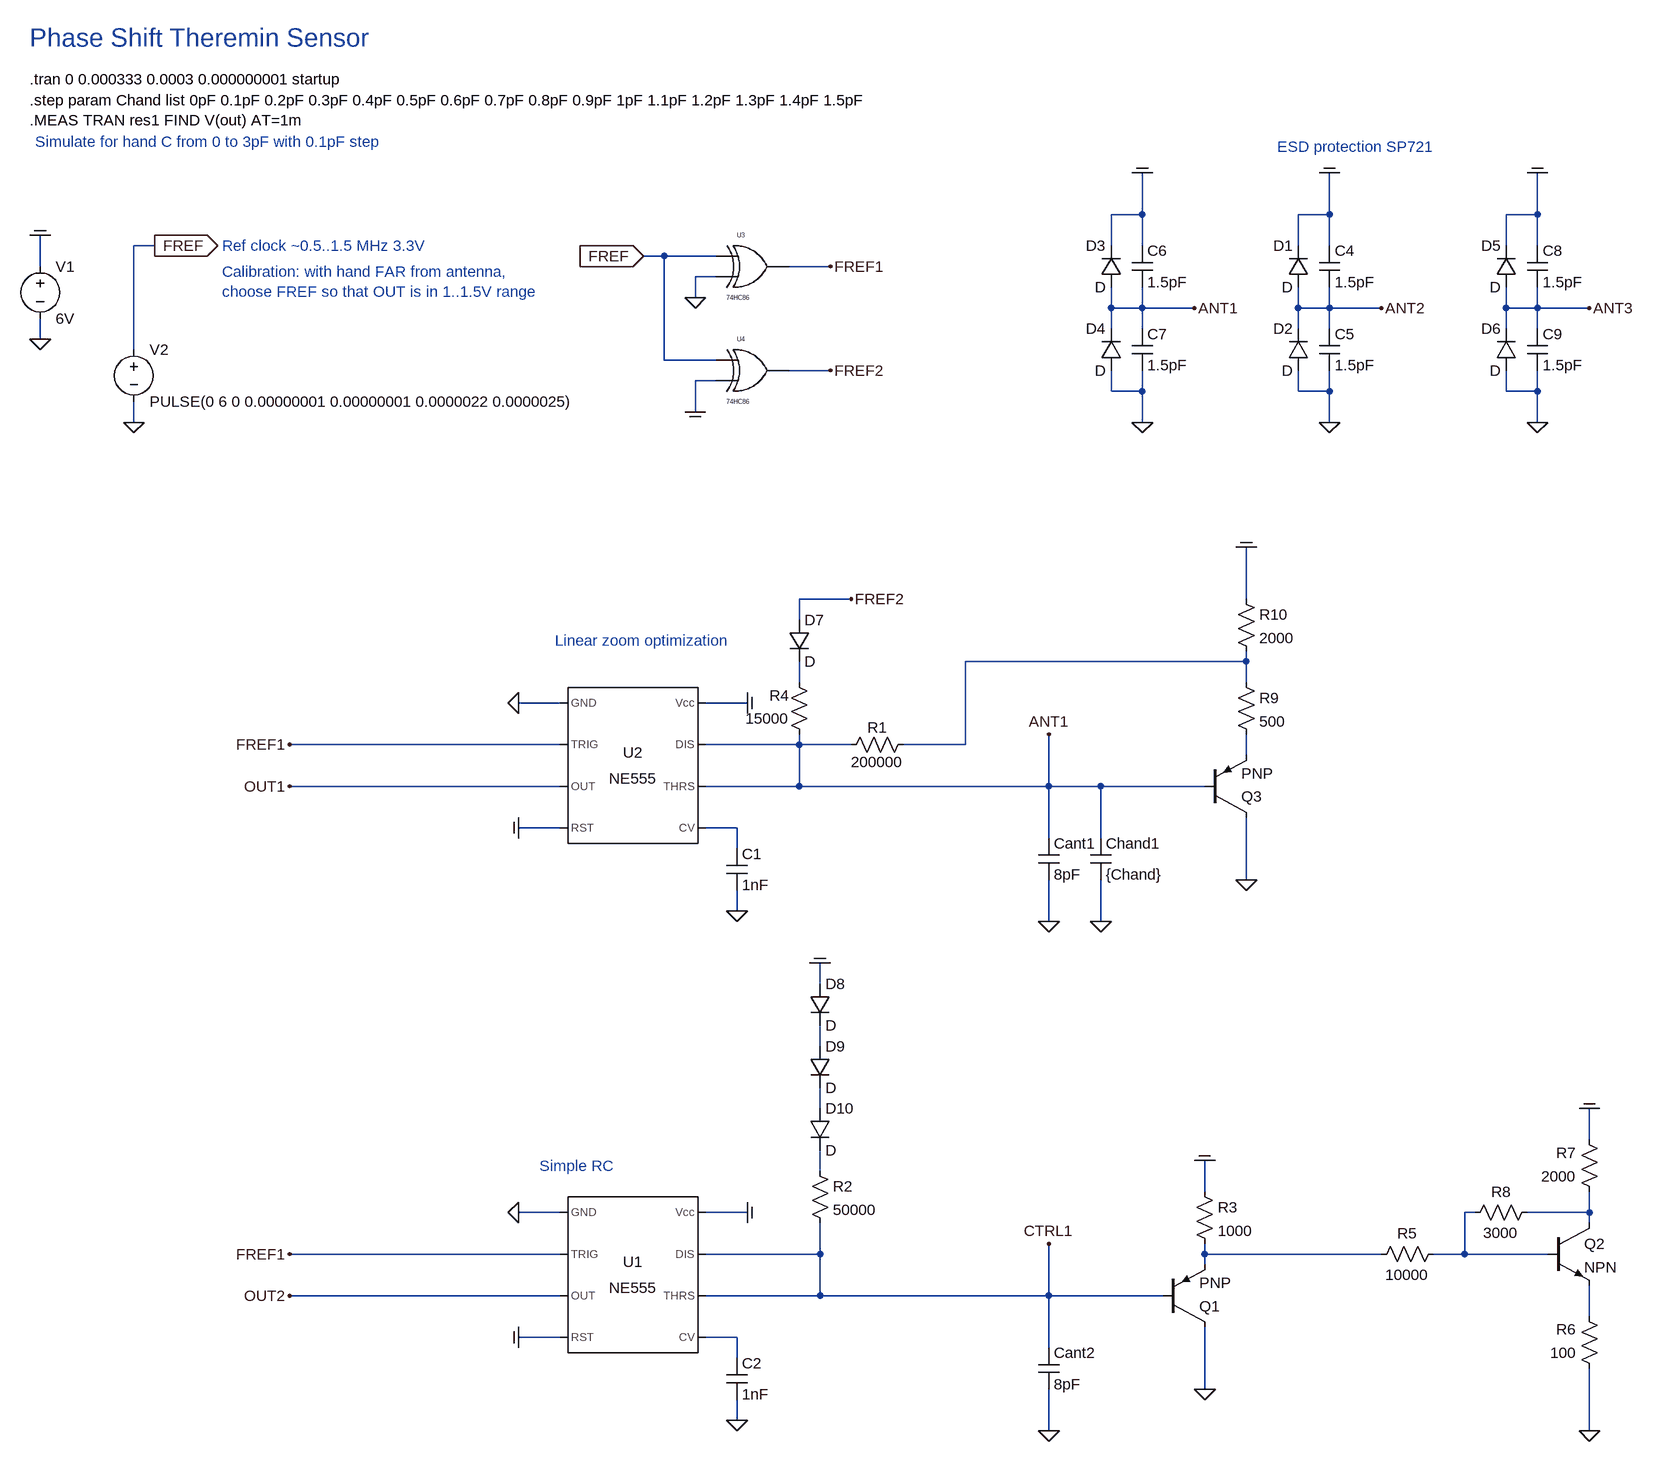
[diagram p0: schematic rc_sensor_v8_fast_linear_logscale.asc]
rc_sensor_v8_fast_linear_logscale.asc, the LTspice schematic file:
Version 4
SHEET 1 3724 2692
WIRE 1744 -96 1744 -160
WIRE 1744 -96 1696 -96
WIRE 2032 -96 2032 -160
WIRE 2032 -96 1984 -96
WIRE 2352 -96 2352 -160
WIRE 2352 -96 2304 -96
WIRE 224 -48 192 -48
WIRE 1696 -48 1696 -96
WIRE 1744 -48 1744 -96
WIRE 1984 -48 1984 -96
WIRE 2032 -48 2032 -96
WIRE 2304 -48 2304 -96
WIRE 2352 -48 2352 -96
WIRE 1008 -32 976 -32
WIRE 1088 -32 1008 -32
WIRE 48 -16 48 -64
WIRE 1264 -16 1200 -16
WIRE 1088 0 1056 0
WIRE 1056 32 1056 0
WIRE 1696 48 1696 16
WIRE 1744 48 1744 16
WIRE 1744 48 1696 48
WIRE 1824 48 1744 48
WIRE 1984 48 1984 16
WIRE 2032 48 2032 16
WIRE 2032 48 1984 48
WIRE 2112 48 2032 48
WIRE 2304 48 2304 16
WIRE 2352 48 2352 16
WIRE 2352 48 2304 48
WIRE 2432 48 2352 48
WIRE 1696 80 1696 48
WIRE 1744 80 1744 48
WIRE 1984 80 1984 48
WIRE 2032 80 2032 48
WIRE 2304 80 2304 48
WIRE 2352 80 2352 48
WIRE 48 96 48 64
WIRE 192 112 192 -48
WIRE 1008 128 1008 -32
WIRE 1088 128 1008 128
WIRE 1264 144 1200 144
WIRE 1088 160 1056 160
WIRE 1696 176 1696 144
WIRE 1744 176 1744 144
WIRE 1744 176 1696 176
WIRE 1984 176 1984 144
WIRE 2032 176 2032 144
WIRE 2032 176 1984 176
WIRE 2304 176 2304 144
WIRE 2352 176 2352 144
WIRE 2352 176 2304 176
WIRE 1056 208 1056 160
WIRE 192 224 192 192
WIRE 1744 224 1744 176
WIRE 2032 224 2032 176
WIRE 2352 224 2352 176
WIRE 1296 496 1216 496
WIRE 1904 496 1904 416
WIRE 1216 528 1216 496
WIRE 1904 592 1904 576
WIRE 1904 592 1472 592
WIRE 1216 624 1216 592
WIRE 1904 624 1904 592
WIRE 848 656 784 656
WIRE 1136 656 1072 656
WIRE 848 720 432 720
WIRE 1216 720 1216 704
WIRE 1216 720 1072 720
WIRE 1296 720 1216 720
WIRE 1472 720 1472 592
WIRE 1472 720 1376 720
WIRE 1904 736 1904 704
WIRE 848 784 432 784
WIRE 1216 784 1216 720
WIRE 1216 784 1072 784
WIRE 1600 784 1600 704
WIRE 1600 784 1216 784
WIRE 1680 784 1600 784
WIRE 1840 784 1680 784
WIRE 848 848 784 848
WIRE 1120 848 1072 848
WIRE 1600 864 1600 784
WIRE 1680 864 1680 784
WIRE 1120 880 1120 848
WIRE 1904 928 1904 832
WIRE 1120 976 1120 944
WIRE 1600 992 1600 928
WIRE 1680 992 1680 928
WIRE 1248 1088 1248 1056
WIRE 1248 1184 1248 1152
WIRE 1248 1280 1248 1248
WIRE 2432 1328 2432 1280
WIRE 1248 1376 1248 1344
WIRE 1840 1408 1840 1360
WIRE 848 1440 784 1440
WIRE 1136 1440 1072 1440
WIRE 2256 1440 2240 1440
WIRE 2432 1440 2432 1408
WIRE 2432 1440 2336 1440
WIRE 2432 1456 2432 1440
WIRE 848 1504 432 1504
WIRE 1248 1504 1248 1456
WIRE 1248 1504 1072 1504
WIRE 1840 1504 1840 1488
WIRE 2112 1504 1840 1504
WIRE 2240 1504 2240 1440
WIRE 2240 1504 2192 1504
WIRE 2368 1504 2240 1504
WIRE 1840 1520 1840 1504
WIRE 848 1568 432 1568
WIRE 1248 1568 1248 1504
WIRE 1248 1568 1072 1568
WIRE 1600 1568 1600 1488
WIRE 1600 1568 1248 1568
WIRE 1776 1568 1600 1568
WIRE 2432 1600 2432 1552
WIRE 848 1632 784 1632
WIRE 1120 1632 1072 1632
WIRE 1600 1648 1600 1568
WIRE 1120 1664 1120 1632
WIRE 1840 1712 1840 1616
WIRE 1120 1760 1120 1728
WIRE 1600 1776 1600 1712
WIRE 2432 1776 2432 1680
FLAG 48 96 0
FLAG 224 -48 FREF
IOPIN 224 -48 Out
FLAG 192 224 0
FLAG 1600 704 ANT1
FLAG 1600 992 0
FLAG 1680 992 0
FLAG 48 -64 COM
FLAG 1744 224 0
FLAG 1744 -160 COM
FLAG 1824 48 ANT1
FLAG 1136 656 COM
FLAG 784 656 0
FLAG 784 848 COM
FLAG 1120 976 0
FLAG 432 784 OUT1
FLAG 1056 32 0
FLAG 1056 208 COM
FLAG 976 -32 FREF
IOPIN 976 -32 In
FLAG 1264 -16 FREF1
FLAG 1264 144 FREF2
FLAG 432 720 FREF1
FLAG 1600 1776 0
FLAG 1136 1440 COM
FLAG 784 1440 0
FLAG 784 1632 COM
FLAG 1120 1760 0
FLAG 1248 1056 COM
FLAG 432 1568 OUT2
FLAG 432 1504 FREF1
FLAG 2032 224 0
FLAG 2032 -160 COM
FLAG 2112 48 ANT2
FLAG 2352 224 0
FLAG 2352 -160 COM
FLAG 2432 48 ANT3
FLAG 1296 496 FREF2
FLAG 1600 1488 CTRL1
FLAG 1840 1712 0
FLAG 1840 1360 COM
FLAG 2432 1280 COM
FLAG 2432 1776 0
FLAG 1904 928 0
FLAG 1904 416 COM
SYMBOL voltage 48 -32 R0
WINDOW 123 0 0 Left 2
WINDOW 39 0 0 Left 2
SYMATTR InstName V1
SYMATTR Value 6V
SYMBOL voltage 192 96 R0
WINDOW 123 0 0 Left 2
WINDOW 39 0 0 Left 2
SYMATTR InstName V2
SYMATTR Value PULSE(0 6 0 0.00000001 0.00000001 0.0000022 0.0000025)
SYMBOL cap 1584 864 R0
SYMATTR InstName Cant1
SYMATTR Value 8pF
SYMBOL cap 1664 864 R0
SYMATTR InstName Chand1
SYMATTR Value {Chand}
SYMBOL res 1392 704 R90
WINDOW 0 5 56 VBottom 2
WINDOW 3 27 56 VTop 2
SYMATTR InstName R1
SYMATTR Value 200000
SYMBOL diode 1712 16 R180
WINDOW 0 24 64 Left 2
WINDOW 3 24 0 Left 2
SYMATTR InstName D3
SYMBOL diode 1712 144 R180
WINDOW 0 24 64 Left 2
WINDOW 3 24 0 Left 2
SYMATTR InstName D4
SYMBOL cap 1728 -48 R0
SYMATTR InstName C6
SYMATTR Value 1.5pF
SYMBOL cap 1728 80 R0
SYMATTR InstName C7
SYMATTR Value 1.5pF
SYMBOL NE555 960 752 R0
SYMATTR InstName U2
SYMBOL cap 1104 880 R0
SYMATTR InstName C1
SYMATTR Value 1nF
SYMBOL cap 1584 1648 R0
SYMATTR InstName Cant2
SYMATTR Value 8pF
SYMBOL res 1232 1360 R0
SYMATTR InstName R2
SYMATTR Value 50000
SYMBOL cap 1104 1664 R0
SYMATTR InstName C2
SYMATTR Value 1nF
SYMBOL diode 2000 16 R180
WINDOW 0 24 64 Left 2
WINDOW 3 24 0 Left 2
SYMATTR InstName D1
SYMBOL diode 2000 144 R180
WINDOW 0 24 64 Left 2
WINDOW 3 24 0 Left 2
SYMATTR InstName D2
SYMBOL cap 2016 -48 R0
SYMATTR InstName C4
SYMATTR Value 1.5pF
SYMBOL cap 2016 80 R0
SYMATTR InstName C5
SYMATTR Value 1.5pF
SYMBOL diode 2320 16 R180
WINDOW 0 24 64 Left 2
WINDOW 3 24 0 Left 2
SYMATTR InstName D5
SYMBOL diode 2320 144 R180
WINDOW 0 24 64 Left 2
WINDOW 3 24 0 Left 2
SYMATTR InstName D6
SYMBOL cap 2336 -48 R0
SYMATTR InstName C8
SYMATTR Value 1.5pF
SYMBOL cap 2336 80 R0
SYMATTR InstName C9
SYMATTR Value 1.5pF
SYMBOL diode 1200 528 R0
SYMATTR InstName D7
SYMBOL res 1232 720 R180
WINDOW 0 31 76 Left 2
WINDOW 3 31 40 Left 2
SYMATTR InstName R4
SYMATTR Value 15000
SYMBOL 74hc86 1136 -80 R0
SYMATTR InstName U3
SYMATTR SpiceLine VCC=6  SPEED=1.0  TRIPDT=1e-9
SYMBOL 74hc86 1136 80 R0
SYMATTR InstName U4
SYMATTR SpiceLine VCC=6  SPEED=1.0  TRIPDT=1e-9
SYMBOL NE555 960 1536 R0
SYMATTR InstName U1
SYMBOL diode 1232 1088 R0
SYMATTR InstName D8
SYMBOL diode 1232 1184 R0
SYMATTR InstName D9
SYMBOL diode 1232 1280 R0
SYMATTR InstName D10
SYMBOL pnp 1776 1616 M180
SYMATTR InstName Q1
SYMBOL res 1824 1392 R0
SYMATTR InstName R3
SYMATTR Value 1000
SYMBOL npn 2368 1456 R0
SYMATTR InstName Q2
SYMBOL res 2208 1488 R90
WINDOW 0 0 56 VBottom 2
WINDOW 3 32 56 VTop 2
SYMATTR InstName R5
SYMATTR Value 10000
SYMBOL res 2448 1696 R180
WINDOW 0 36 76 Left 2
WINDOW 3 36 40 Left 2
SYMATTR InstName R6
SYMATTR Value 100
SYMBOL res 2448 1424 R180
WINDOW 0 36 76 Left 2
WINDOW 3 36 40 Left 2
SYMATTR InstName R7
SYMATTR Value 2000
SYMBOL res 2352 1424 R90
WINDOW 0 0 56 VBottom 2
WINDOW 3 32 56 VTop 2
SYMATTR InstName R8
SYMATTR Value 3000
SYMBOL pnp 1840 832 M180
SYMATTR InstName Q3
SYMBOL res 1888 608 R0
SYMATTR InstName R9
SYMATTR Value 500
SYMBOL res 1888 480 R0
SYMATTR InstName R10
SYMATTR Value 2000
TEXT 32 -304 Left 2 !.tran 0 0.000333 0.0003 0.000000001 startup
TEXT 32 -272 Left 2 !.step param Chand list 0pF 0.1pF 0.2pF 0.3pF 0.4pF 0.5pF 0.6pF 0.7pF 0.8pF 0.9pF 1pF 1.1pF 1.2pF 1.3pF 1.4pF 1.5pF\n.MEAS TRAN res1 FIND V(out) AT=1m
TEXT 328 -48 Left 2 ;Ref clock ~0.5..1.5 MHz 3.3V
TEXT 32 -368 Left 4 ;Phase Shift Theremin Sensor
TEXT 1952 -200 Left 2 ;ESD protection SP721
TEXT 328 -8 Left 2 ;Calibration: with hand FAR from antenna,\nchoose FREF so that OUT is in 1..1.5V range
TEXT 40 -208 Left 2 ;Simulate for hand C from 0 to 3pF with 0.1pF step
TEXT 840 560 Left 2 ;Linear zoom optimization
TEXT 816 1368 Left 2 ;Simple RC

The netlist it stands for:
* rc_sensor_v8_fast_linear_logscale.asc
V1 COM 0 6V
V2 FREF 0 PULSE(0 6 0 0.00000001 0.00000001 0.0000022 0.0000025)
Cant1 ANT1 0 8pF
Chand1 ANT1 0 {Chand}
R1 N001 ANT1 200000
D3 ANT1 COM D
D4 0 ANT1 D
C6 COM ANT1 1.5pF
C7 ANT1 0 1.5pF
XU2 0 FREF1 OUT1 COM N004 ANT1 ANT1 COM NE555  ; pins GND TRIG OUT RST CV THRS DIS Vcc
C1 N004 0 1nF
Cant2 CTRL1 0 8pF
R2 N007 CTRL1 50000
C2 N012 0 1nF
D1 ANT2 COM D
D2 0 ANT2 D
C4 COM ANT2 1.5pF
C5 ANT2 0 1.5pF
D5 ANT3 COM D
D6 0 ANT3 D
C8 COM ANT3 1.5pF
C9 ANT3 0 1.5pF
D7 FREF2 N002 D
R4 ANT1 N002 15000
XU3 FREF 0 FREF1 VCC 0 74HC86 VCC=6  SPEED=1.0  TRIPDT=1e-9  ; pins A B Y
XU4 FREF COM FREF2 VCC 0 74HC86 VCC=6  SPEED=1.0  TRIPDT=1e-9  ; pins A B Y
XU1 0 FREF1 OUT2 COM N012 CTRL1 CTRL1 COM NE555  ; pins GND TRIG OUT RST CV THRS DIS Vcc
D8 COM N005 D
D9 N005 N006 D
D10 N006 N007 D
Q1 0 CTRL1 N010 0 PNP
R3 COM N010 1000
Q2 N009 N008 N011 0 NPN
R5 N008 N010 10000
R6 0 N011 100
R7 N009 COM 2000
R8 N009 N008 3000
Q3 0 ANT1 N003 0 PNP
R9 N001 N003 500
R10 COM N001 2000
.model D D
.lib standard.dio
.model NPN NPN
.model PNP PNP
.lib standard.bjt
.tran 0 0.000333 0.0003 0.000000001 startup
.step param Chand list 0pF 0.1pF 0.2pF 0.3pF 0.4pF 0.5pF 0.6pF 0.7pF 0.8pF 0.9pF 1pF 1.1pF 1.2pF 1.3pF 1.4pF 1.5pF
.MEAS TRAN res1 FIND V(out) AT=1m
* Ref clock ~0.5..1.5 MHz 3.3V
* Phase Shift Theremin Sensor
* ESD protection SP721
* Calibration: with hand FAR from antenna,
* choose FREF so that OUT is in 1..1.5V range
* Simulate for hand C from 0 to 3pF with 0.1pF step
* Linear zoom optimization
* Simple RC
.lib NE555.sub
.lib 74HC.lib
.backanno
.end